# EAGLE design DMG-HDP-01_1-2 (EAGLE 9.6.2)
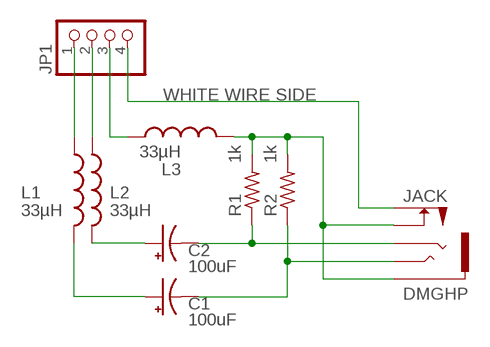
[diagram p0: schematic, sheet 1]

## Parts
C1  100uF  CPOL-USE2.5-5  [E2,5-5]
C2  100uF  CPOL-USE2.5-5  [E2,5-5]
JACK  DMGHP  [DMG-HEADPHONE]
JP1  PINHD-1X4  [1X04]
L1  33µH  L-US0204/7  [0204/7]
L2  33µH  L-US0204/7  [0204/7]
L3  33µH  L-US0204/7  [0204/7]
R1  1k  R-US_R0603  [R0603]
R2  1k  R-US_R0603  [R0603]

## Nets
N$1: JP1.1 L1.1
N$2: JP1.3 L3.1
N$3: JP1.2 L2.1
N$4: C1.+ L1.2
N$5: C2.+ L2.2
N$6: JACK.GND(S) JACK.SWGND(SWB) L3.2 R1.2 R2.2
N$7: JACK.SW(SWA) JP1.4
N$8: C2.- JACK.R R1.1
N$9: C1.- JACK.T R2.1

## Notes on the sheet
- WHITE WIRE SIDE

## Library data of the parts
C1 C2 = rcl:CPOL-US: POLARIZED CAPACITOR, American symbol; SPICEPREFIX: C
JACK = Game Boy:DMGHP
JP1 = pinhead:PINHD-1X4: PIN HEADER
L1-L3 = rcl:L-US: INDUCTOR, American symbol; SPICEPREFIX: L
R1 R2 = rcl:R-US_: RESISTOR, American symbol; SPICEPREFIX: R

## Board
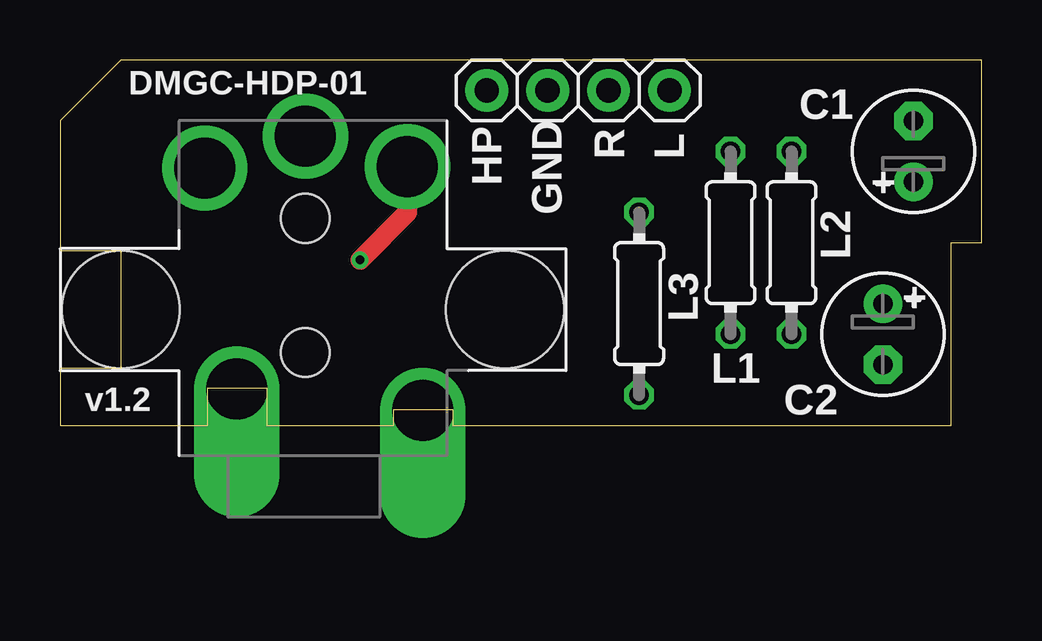
[diagram p1: board, top side]
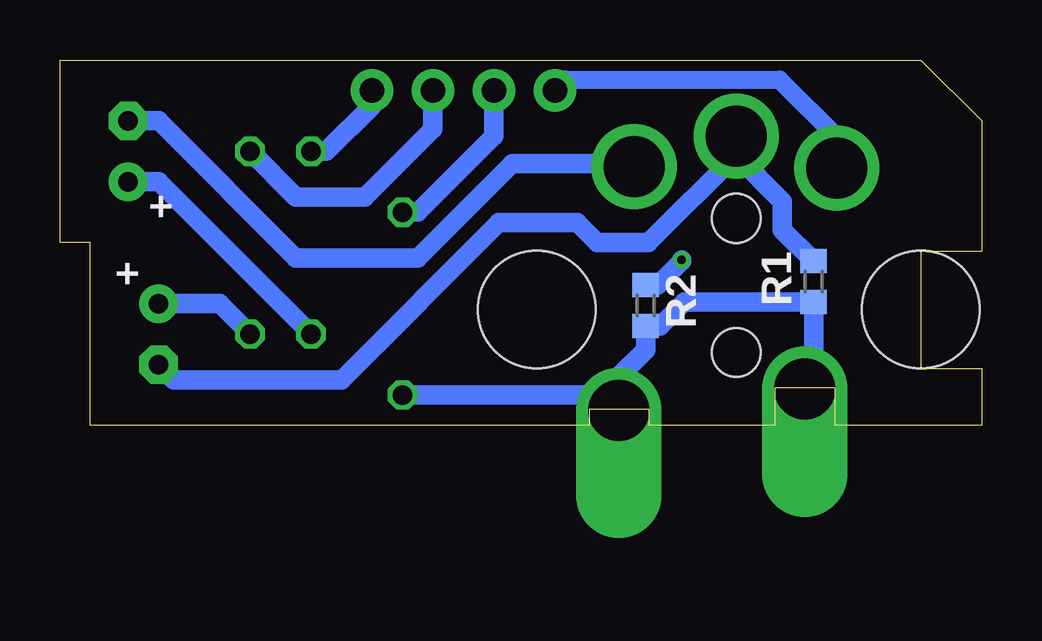
[diagram p2: board, bottom side, seen from below]

Size 38.4 x 15.24 mm. Coordinates in mm from the lower left corner, seen from the top.
Outline: 0,0 6.12,0 6.12,1.57 8.62,1.57 8.62,0 13.88,0 13.88,0.66 16.36,0.66 16.36,0 37.13,0 37.13,7.62 38.4,7.62 38.4,15.24 2.54,15.24 0,12.7 0,7.28 2.53,7.28 2.54,7.27 2.54,2.38 2.53,2.37 0,2.37 0,0
Copper layers (1*16): Top 0.0356mm / dielectric 1.5011mm / Bottom 0.0356mm
Design rules "jlcpcb *": minimum track width 8mil, minimum drill 13mil, track to track 8mil, track to pad 8mil, pad to pad 8mil, via to via 8mil, smd to smd 5mil, copper to edge 15mil, drill to drill 22mil, minimum pad ring 7mil, minimum via ring 7mil, stop-mask expansion 2.5mil, vias tented up to drill 15mil, thermal gap 10mil

### Footprints (pad centres in the part's own frame; a part is rotated, then mirrored left to right if it is on the bottom)
E2,5-5 = drill 0.813 pad 1.6: + -1.27,0 | drill 0.813 pad 1.6 octagon: - 1.27,0
DMG-HEADPHONE = drill 2.54 offset: GND 3.683,-5.715; SWGND -4.064,-4.826 | drill 2.54: R -1.206,5.715; SW -5.397,4.381; T 3.048,4.445 | hole 4.902: -8.89,-1.524; 7.112,-1.524 | hole 2.032: -1.206,2.286; -1.206,-3.302
1X04 = drill 1.016 pad 1.778: 1 -3.81,0; 2 -1.27,0; 3 1.27,0; 4 3.81,0
0204/7 = drill 0.813 octagon: 1 -3.81,0; 2 3.81,0
R0603 = smd 1 x 1.1: 1 -0.85,0; 2 0.85,0

### Placement (x,y rotation side)
C1  35.56,11.43 90 top
C2  34.29,3.81 270 top
JACK  11.43,6.35 0 top
JP1  21.59,13.97 180 top
L1  27.94,7.62 270 top
L2  30.48,7.62 270 top
L3  24.13,5.08 270 top
R1  7,6 270 bottom
R2  14,5 270 bottom

### Tracks (layer width: path | path; a pad name or v marks a point on that pad's centre or on a via)
N$1
  Bottom 0.813: JP1.1 25.4,13.34 27.3,11.43 L1.1
N$2
  Bottom 0.813: L3.1 23.5,8.89 20.32,12.06 JP1.3
N$3
  Bottom 0.813: JP1.2 22.86,12.37 25.7,9.53 28.57,9.53 L2.1
N$4
  Bottom 0.813: L1.2 34.29,10.16 C1.+
N$5
  Bottom 0.813: C2.+ 31.75,5.08 L2.2
N$6
  Bottom 0.813: L3.2 15.49,1.27 JACK.GND | JACK.GND 15.49,0.58 | JACK.SWGND 7.37,2 7,2.37 R1.2 12.39,5.15 13.39,4.15 R2.2 14,3.15 15.11,2.04 JACK.GND
N$7
  Bottom 0.75: JP1.4 17.33,14.42 8.42,14.42 6,12 6,10.76 JACK.SW
N$8
  Bottom 0.813: C2.- 33.66,1.91 26.67,1.91 20.12,8.46 16.84,8.46 16.01,7.62 13.88,7.62 10.23,11.27 8.3,9.34 8.3,8.15 R1.1 | 10.22,11.55 JACK.R
N$9  (via drill 0.35)
  Top 0.813: JACK.T 14.48,8.88 v12.5,6.9
  Bottom 0.813: C1.- 34.29,12.7 28.57,6.99 23.5,6.99 19.56,10.92 14.61,10.92 JACK.T | v12.5,6.9 12.5,6.85 13.5,5.85 R2.1

### Text on the board
tNames: DMGC-HDP-01 | R | L | HP | + | GND | + | v1.2
bNames: + | +